# EasyEDA schematic SCH_Pico-Greenhouse-PCB_2026-05-27.json
TITLE: Greenhouse-Pico; REV: 2.2; Date: 2026-05-27; Sheet: 1/1; Drawn By: hiroyugane
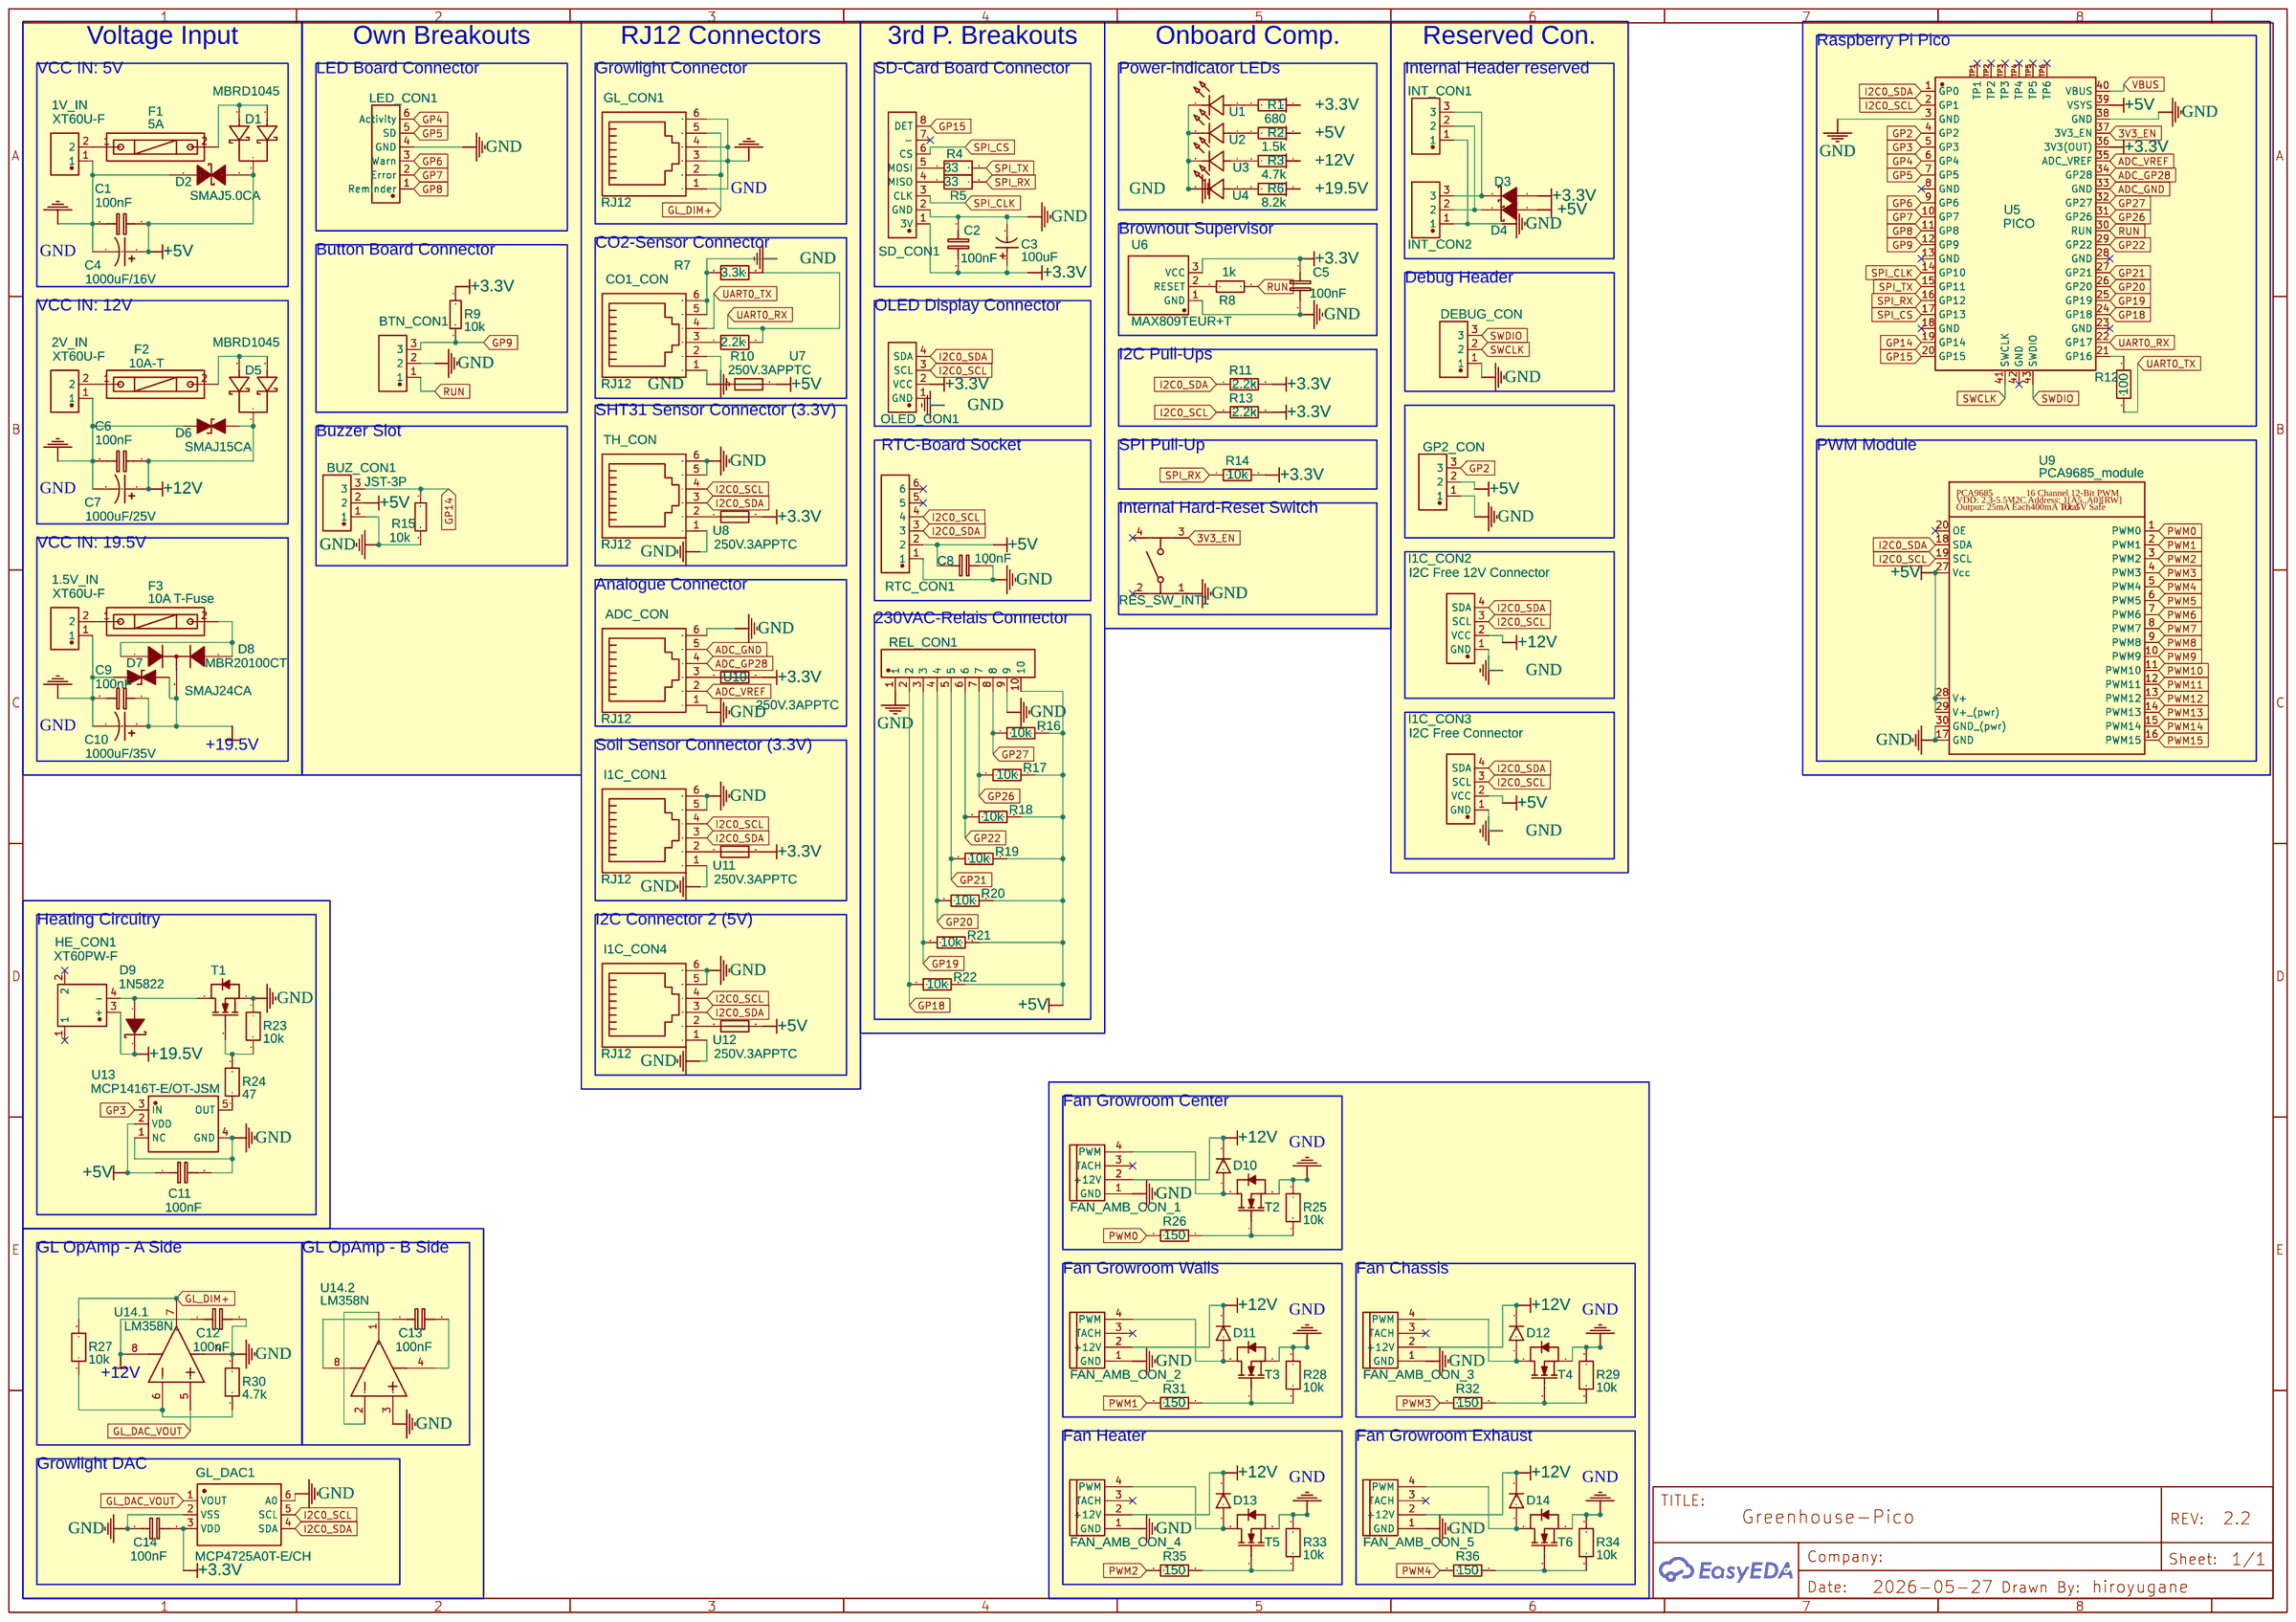
[diagram p0: schematic sheet]

## Parts
1.5V_IN  XT60U-F  [CONN-TH_XT60U-F]
1V_IN  XT60U-F  [CONN-TH_XT60U-F]
2V_IN  XT60U-F  [CONN-TH_XT60U-F]
ADC_CON  RJ12  [RJ12-TH_95501-2661]
BTN_CON1  Reset / Menu Button  [BUZ_CON]
BUZ_CON1  JST-3P  [BUZ_CON]
C1  100nF  [CONDENSATOR-SMALL]
C2  100nF  [CONDENSATOR-SMALL]
C3  100uF  [CAP-TH_BD5.0-P2.00-D0.8-FD]
C4  1000uF/16V  [CAP-TH_BD12.5-P5.00-D0.8-FD]
C5  100nF  [CONDENSATOR-SMALL]
C6  100nF  [CONDENSATOR-SMALL]
C7  1000uF/25V  [CAP-TH_BD12.5-P5.00-D0.8-FD]
C8  100nF  [CONDENSATOR-SMALL]
C9  100nF  [CONDENSATOR-SMALL]
C10  1000uF/35V  [CAP-TH_BD12.5-P5.00-D0.8-FD]
C11  100nF  [CONDENSATOR-SMALL]
C12  100nF  [CONDENSATOR-SMALL]
C13  100nF  [CONDENSATOR-SMALL]
C14  100nF  [CONDENSATOR-SMALL]
CO1_CON  RJ12  [RJ12-TH_95501-2661]
D1  MBRD1045  [TO-252-3_L6.5-W5.9-P4.60-LS10.0-BL]
D2  SMAJ5.0CA  [SMA_L4.4-W2.6-LS5.0-BI]
D3  SS14  [SMA_L4.2-W2.6-LS5.0-RD_1]
D4  SS14  [SMA_L4.2-W2.6-LS5.0-RD_1]
D5  MBRD1045  [TO-252-3_L6.5-W5.9-P4.60-LS10.0-BL]
D6  SMAJ15CA  [SMA_L4.4-W2.6-LS5.0-BI]
D7  SMAJ24CA  [SMA_L4.4-W2.6-LS5.0-BI]
D8  MBR20100CT  [TO-220-3_L10.0-W4.5-P2.54-L]
D9  1N5822  [DO-201AD_BD5.3-L8.4-P12.50-D1.4-FD]
D10  UF4007_C84067  [DO-41_BD2.4-L4.7-P8.70-D0.9-FD]
D11  UF4007_C84067  [DO-41_BD2.4-L4.7-P8.70-D0.9-FD]
D12  UF4007_C84067  [DO-41_BD2.4-L4.7-P8.70-D0.9-FD]
D13  UF4007_C84067  [DO-41_BD2.4-L4.7-P8.70-D0.9-FD]
D14  UF4007_C84067  [DO-41_BD2.4-L4.7-P8.70-D0.9-FD]
DEBUG_CON  B3B-XH-A-BK(LF)(SN)  [CONN-TH_3P-P2.50_B3B-XH-A-BK-LF-SN]
F1  5A  [FUSE-TH_L22.6-W9.0]
F2  10A-T  [FUSE-TH_L22.6-W9.0]
F3  10A T-Fuse  [FUSE-TH_L22.6-W9.0]
FAN_AMB_CON_1  XH2.54-4AW  [CONN-TH_XH2.54-4AW]
FAN_AMB_CON_2  XH2.54-4AW  [CONN-TH_XH2.54-4AW]
FAN_AMB_CON_3  XH2.54-4AW  [CONN-TH_XH2.54-4AW]
FAN_AMB_CON_4  XH2.54-4AW  [CONN-TH_XH2.54-4AW]
FAN_AMB_CON_5  XH2.54-4AW  [CONN-TH_XH2.54-4AW]
GL_CON1  RJ12  [RJ12-TH_95501-2661]
GL_DAC1  MCP4725A0T-E/CH  [SOT-23-6_L2.9-W1.6-P0.95-LS2.8-BL]
GP2_CON  GP2 Reserved  [CONN-TH_3P-P2.50_B3B-XH-A-BK-LF-SN]
HE_CON1  XT60PW-F  [TH_2P-XT60PW-F]
I1C_CON1  RJ12  [RJ12-TH_95501-2661]
I1C_CON2  I2C Free 12V Connector  [CONN-TH_4P-P2.50_JST_B4B-XH-A-M]
I1C_CON3  I2C Free Connector  [CONN-TH_4P-P2.50_JST_B4B-XH-A-M]
I1C_CON4  RJ12  [RJ12-TH_95501-2661]
INT_CON1  GP2 Reserved  [CONN-TH_3P-P2.50_B3B-XH-A-BK-LF-SN]
INT_CON2  GP2 Reserved  [CONN-TH_3P-P2.50_B3B-XH-A-BK-LF-SN]
LED_CON1  Led-PCB-Connector  [CONN-TH_6P-P2.50_JST_B6B-EH-LF-SN]
OLED_CON1  JST-4P  [CONN-TH_4P-P2.50_JST_B4B-XH-A-M]
R1  680  [RES-TH_BD2.3-L6.5-P6.9-D0.5]
R2  1.5k  [RES-TH_BD2.3-L6.5-P6.9-D0.5]
R3  4.7k  [RES-TH_BD2.3-L6.5-P6.9-D0.5]
R4  33  [R_TH]
R5  33  [R_TH]
R6  8.2k  [RES-TH_BD2.3-L6.5-P6.9-D0.5]
R7  3.3k  [R_TH]
R8  1k  [RES-TH_BD2.3-L6.5-P6.9-D0.5]
R9  10k  [RES-TH_BD2.3-L6.5-P6.9-D0.5]
R10  2.2k  [R_TH]
R11  2.2k  [RES-TH_BD2.3-L6.5-P6.9-D0.5]
R12  100  [R_TH]
R13  2.2k  [RES-TH_BD2.3-L6.5-P6.9-D0.5]
R14  10k  [RES-TH_BD2.3-L6.5-P6.9-D0.5]
R15  10k  [RES-TH_BD2.3-L6.5-P6.9-D0.5]
R16  10k  [RES-TH_BD2.3-L6.5-P6.9-D0.5]
R17  10k  [RES-TH_BD2.3-L6.5-P6.9-D0.5]
R18  10k  [RES-TH_BD2.3-L6.5-P6.9-D0.5]
R19  10k  [RES-TH_BD2.3-L6.5-P6.9-D0.5]
R20  10k  [RES-TH_BD2.3-L6.5-P6.9-D0.5]
R21  10k  [RES-TH_BD2.3-L6.5-P6.9-D0.5]
R22  10k  [RES-TH_BD2.3-L6.5-P6.9-D0.5]
R23  10k  [R_TH]
R24  47  [R_TH]
R25  10k  [R_TH]
R26  150  [RES-TH_BD2.3-L6.5-P6.9-D0.5]
R27  10k  [R_TH]
R28  10k  [R_TH]
R29  10k  [R_TH]
R30  4.7k  [R_TH]
R31  150  [RES-TH_BD2.3-L6.5-P6.9-D0.5]
R32  150  [RES-TH_BD2.3-L6.5-P6.9-D0.5]
R33  10k  [R_TH]
R34  10k  [R_TH]
R35  150  [RES-TH_BD2.3-L6.5-P6.9-D0.5]
R36  150  [RES-TH_BD2.3-L6.5-P6.9-D0.5]
REL_CON1  CONN-TH-10P  [CONN-TH_10P-P2.50_JST_B10B-EH]
RES_SW_INT1  Button  [SW-TH_4P-L6.0-W6.0-P4.50-LS6.1]
RTC_CON1  JST-6P  [RTC-CHIP FOOTPRINT]
SD_CON1  Adafruit SD Con  [CONN-TH_8P-P2.50-XH2.54-8P]
T1  IRLZ44NPBF-VB  [TO-220-3_L10.0-W4.5-P2.54-L-2]
T2  IRLZ44NPBF-VB  [TO-220-3_L10.0-W4.5-P2.54-L-2]
T3  IRLZ44NPBF-VB  [TO-220-3_L10.0-W4.5-P2.54-L-2]
T4  IRLZ44NPBF-VB  [TO-220-3_L10.0-W4.5-P2.54-L-2]
T5  IRLZ44NPBF-VB  [TO-220-3_L10.0-W4.5-P2.54-L-2]
T6  IRLZ44NPBF-VB  [TO-220-3_L10.0-W4.5-P2.54-L-2]
TH_CON  RJ12  [RJ12-TH_95501-2661]
U1  3RC  [LED-TH_BD3.0-2P-P2.50]
U2  3RC  [LED-TH_BD3.0-2P-P2.50]
U3  3RC  [LED-TH_BD3.0-2P-P2.50]
U4  3RC  [LED-TH_BD3.0-2P-P2.50]
U5  PICO  [RPI-PICO-V2]
U6  MAX809TEUR+T  [SOT-23-3_L2.9-W1.6-P1.90-LS2.8-BR]
U7  250V.3APPTC  [FUSE-TH_L11.4-W3.0-P5.10-D0.8-S1.20]
U8  250V.3APPTC  [FUSE-TH_L11.4-W3.0-P5.10-D0.8-S1.20]
U9  PCA9685_module  [PCA9685]
U10  250V.3APPTC  [FUSE-TH_L11.4-W3.0-P5.10-D0.8-S1.20]
U11  250V.3APPTC  [FUSE-TH_L11.4-W3.0-P5.10-D0.8-S1.20]
U12  250V.3APPTC  [FUSE-TH_L11.4-W3.0-P5.10-D0.8-S1.20]
U13  MCP1416T-E/OT-JSM  [SOT-23-5_L3.0-W1.6-P0.95-LS2.8-BR]
U14  LM358N  [PDIP-8_L10.2-W5.9-P2.54-LS7.6-BL]  (sections 1,2)

## Library data of the parts
1.5V_IN 1V_IN 2V_IN = XT60U-F: Supplier: LCSC; Supplier Part: C19191801; Manufacturer: AMASS(艾迈斯); JLCPCB Part Class: Extended Part; Contributor: lcsc
ADC_CON CO1_CON GL_CON1 I1C_CON1 I1C_CON4 TH_CON = 95501-2661: Contributor: LCSC; Supplier: LCSC; Supplier Part: C240856; Manufacturer: MOLEX; Manufacturer Part: 955012661; JLCPCB Part Class: Extended Part
BTN_CON1 BUZ_CON1 DEBUG_CON GP2_CON INT_CON1 INT_CON2 = B3B-XH-A-BK(LF)(SN): Contributor: LCSC; Supplier: LCSC; Supplier Part: C493416; Manufacturer: JST; JLCPCB Part Class: Extended Part
C1 C2 C5 C6 C8 C9 C11-C14 = C_0603_EU: Contributor: LCEDA_Lib
C3 = 100uf/10V: Supplier: LCSC; Manufacturer: Chengx(承兴); Manufacturer Part: KM107M010D11RR0VH2FP0; Supplier Part: C2035; JLCPCB Part Class: Extended Part
C4 C7 C10 = 50ZLJ1000M12.5X30: Contributor: lcsc; Supplier: LCSC; Supplier Part: C5115376; Manufacturer: rubycon(红宝石)
D1 D5 = MBRD1045: Supplier: LCSC; Supplier Part: C5137764; Manufacturer: GOODWORK(固得沃克); JLCPCB Part Class: Extended Part; Contributor: lcsc
D2 = SMAJ5.0CA_C143136: Contributor: LCSC; Supplier Part: C143136; Supplier: LCSC; Manufacturer: FMS(美丽微); JLCPCB Part Class: Extended Part
D3 D4 = SS14: Supplier: LCSC; Manufacturer: MDD(辰达半导体); Supplier Part: C2480; JLCPCB Part Class: Basic Part
D6 = SMAJ15CA: Supplier: LCSC; Manufacturer: RUILON(瑞隆源); Supplier Part: C46985; JLCPCB Part Class: Extended Part
D7 = SMAJ24CA: Supplier: LCSC; Manufacturer: RUILON(瑞隆源); Supplier Part: C28092; JLCPCB Part Class: Extended Part
D8 = MBR20100CT: Supplier: LCSC; Manufacturer: CJ(江苏长电/长晶); Supplier Part: C98706; JLCPCB Part Class: Extended Part
D9 = 1N5822: Supplier: LCSC; Manufacturer: MDD(辰达半导体); Supplier Part: C2476; JLCPCB Part Class: Extended Part
D10-D14 = UF4007_C84067: Contributor: 立创EDA官方封装库; Supplier: LCSC; Manufacturer: 星海; Manufacturer Part: UF4007; Supplier Part: C84067; JLCPCB Part Class: Extended Part
F1-F3 = 5x20 BLX-Atype Fuse holder XC-7: Supplier: LCSC; Manufacturer Part: 5x20 BLX-A型 保险丝支架 XC-7; Manufacturer: xcfuse(旭程); Supplier Part: C3131; JLCPCB Part Class: Extended Part
FAN_AMB_CON_1-FAN_AMB_CON_5 = XH2.54-4AW: Supplier: LCSC; Manufacturer: BOOMELE(博穆精密); Manufacturer Part: XH-4AW; Supplier Part: C21273; JLCPCB Part Class: Extended Part
GL_DAC1 = MCP4725A0T-E/CH: Contributor: LCSC; Supplier: LCSC; Manufacturer: MICROCHIP(美国微芯); Supplier Part: C144198; JLCPCB Part Class: Extended Part
HE_CON1 = XT60PW-F_C428722: Supplier: LCSC; Supplier Part: C428722; Manufacturer: AMASS(艾迈斯); JLCPCB Part Class: Extended Part; Contributor: lcsc
I1C_CON2 I1C_CON3 OLED_CON1 = B4B-XH-A-R(LF)(SN): Contributor: lcsc; Supplier: LCSC; Supplier Part: C595709; Manufacturer: JST; JLCPCB Part Class: Extended Part
LED_CON1 = B6B-EH(LF)(SN): Contributor: LCSC; Supplier: LCSC; Supplier Part: C493147; Manufacturer: JST; JLCPCB Part Class: Extended Part
R1-R3 R6 R8 R9 R11 R13-R22 R26 R31 R32 R35 R36 = 330Ω (331) ±5%: Contributor: LCSC; Supplier: LCSC; Supplier Part: C10322; Manufacturer: Made in China; JLCPCB Part Class: Extended Part
R4 R5 R7 R10 R12 R23-R25 R27-R30 R33 R34 = R_0603_EU: Contributor: LCEDA_Lib
REL_CON1 = B10B-EH(LF)(SN): Contributor: lcsc; Supplier: LCSC; Supplier Part: C265062; Manufacturer: JST; JLCPCB Part Class: Extended Part
RES_SW_INT1 = Button-6x6x6mm: Supplier Part: C71836; Supplier: LCSC; Manufacturer: BBJ; Manufacturer Part: Switch,6*6*6Plastic head,260G, 0.25mm,Straight line
RTC_CON1 = ZX-PM2.54-1-6PY: Supplier: LCSC; Supplier Part: C7499326; Manufacturer: Megastar(兆星); Contributor: lcsc; JLCPCB Part Class: Extended Part
SD_CON1 = HDGC2501WV-8P: Supplier: LCSC; Supplier Part: C5175254; Manufacturer: HDGC(华德共创); JLCPCB Part Class: Extended Part; Contributor: lcsc
T1-T6 = IRLZ44NPBF-VB: Supplier: LCSC; Supplier Part: C20755022; Manufacturer: VBsemi(微碧半导体); JLCPCB Part Class: Extended Part; Contributor: lcsc
U1-U4 = 3RC: Supplier: LCSC; Supplier Part: C19479802; Manufacturer: BIVAR; JLCPCB Part Class: Extended Part; Contributor: lcsc
U5 = PICO: Supplier: LCSC; Supplier Part: C7203002; Manufacturer: Raspberry Pi(树莓派); Contributor: lcsc; JLCPCB Part Class: Extended Part
U6 = MAX809TEUR+T: Supplier: LCSC; Manufacturer: ADI(亚德诺)/MAXIM(美信); Supplier Part: C16711; JLCPCB Part Class: Extended Part
U7 U8 U10-U12 = 30V3APPTC: Contributor: lcsc; Supplier: LCSC; Supplier Part: C9900014925; Manufacturer: null; JLCPCB Part Class: Extended Part
U9 = PCA9685_module: Contributor: Quentin Chatenet
U13 = MCP1416T-E/OT-JSM: Supplier: LCSC; Supplier Part: C18195002; Manufacturer: JSMSEMI(杰盛微); Contributor: lcsc; JLCPCB Part Class: Extended Part
U14 = LM358N: subpart_no: 1; Supplier: LCSC; Supplier Part: C83405; Manufacturer: TI(德州仪器); Manufacturer Part: LM358N/NOPB; JLCPCB Part Class: Extended Part

## Nets
3V3_EN: RES_SW_INT1.3 U5.37(3V3_EN)
+3.3V: C2.2 C3.1 C5.1 C14.2 D3.2(A) GL_DAC1.3(VDD) OLED_CON1.2(VCC) R1.1 R9.2 R11.2 R13.2 R14.2 SD_CON1.1(3V) U5.36(3V3(OUT)) U6.3(VCC) U8.2 U10.2 U11.2
+5V: BUZ_CON1.2 C1.1 C4.1 C8.1 C11.1 D1.2(K) D2.1 D4.2(A) GP2_CON.2 I1C_CON3.2(VCC) R2.1 R16.2 R17.2 R18.2 R19.2 R20.2 R21.2 R22.2 REL_CON1.10 RTC_CON1.2 U5.39(VSYS) U7.2 U9.27(Vcc) U9.28(V+) U9.29(V+ (pwr)) U12.2 U13.2(VDD)
+12V: C6.1 C7.1 C12.1 D5.2(K) D6.1(K) D10.2(C) D11.2(C) D12.2(C) D13.2(C) D14.2(C) FAN_AMB_CON_1.2(+12V) FAN_AMB_CON_2.2(+12V) FAN_AMB_CON_3.2(+12V) FAN_AMB_CON_4.2(+12V) FAN_AMB_CON_5.2(+12V) I1C_CON2.2(VCC) R3.1
+19.5V: C9.1 C10.1 D7.1(K) D8.2(C) D9.2(K) HE_CON1.3(+) R6.1
GND: 1.5V_IN.1 1V_IN.1 2V_IN.1 ADC_CON.1 ADC_CON.6 BTN_CON1.2 BUZ_CON1.1 C1.2 C2.1 C3.2 C4.2 C5.2 C6.2 C7.2 C8.2 C9.2 C10.2 C11.2 C12.2 C14.1 CO1_CON.1 CO1_CON.5 CO1_CON.6 D2.2 D6.2(A) D7.2(A) DEBUG_CON.1 FAN_AMB_CON_1.1(GND) FAN_AMB_CON_2.1(GND) FAN_AMB_CON_3.1(GND) FAN_AMB_CON_4.1(GND) FAN_AMB_CON_5.1(GND) GL_CON1.1 GL_CON1.3(GL-) GL_CON1.4(GL-) GL_CON1.6 GL_DAC1.2(VSS) GL_DAC1.6(A0) GP2_CON.1 I1C_CON1.1 I1C_CON1.5 I1C_CON1.6 I1C_CON2.1(GND) I1C_CON3.1(GND) I1C_CON4.1 I1C_CON4.5 I1C_CON4.6 INT_CON1.1 INT_CON2.1 LED_CON1.4(GND) OLED_CON1.1(GND) R7.1 R15.2 R23.1 R25.2 R28.2 R29.2 R30.2 R33.2 R34.2 REL_CON1.1 REL_CON1.9 RES_SW_INT1.1 RTC_CON1.1 SD_CON1.2(GND) T1.3(S) T2.3(S) T3.3(S) T4.3(S) T5.3(S) T6.3(S) TH_CON.1 TH_CON.5 TH_CON.6 U1.2(K) U2.2(K) U3.2(K) U4.2(K) U5.3(GND) U5.38(GND) U6.1(GND) U9.17(GND) U9.30(GND (pwr)) U13.1(NC) U13.4(GND) U14.3(+IN 1)
VBUS: U5.40(VBUS)
ADC_GND: ADC_CON.5 U5.33(GND)
ADC_GP28: ADC_CON.4 U5.34(GP28)
ADC_VREF: ADC_CON.2 U5.35(ADC_VREF)
GL_DAC_VOUT: GL_DAC1.1(VOUT) U14.5(+IN 2)
GL_DIM+: GL_CON1.2(GL+) GL_CON1.5(GL+) R27.2 U14.7(OUT 2)
GP2: GP2_CON.3 U5.4(GP2)
GP3: U5.5(GP3) U13.3(IN)
GP4: LED_CON1.6(Activity) U5.6(GP4)
GP5: LED_CON1.5(SD) U5.7(GP5)
GP6: LED_CON1.3(Warn) U5.9(GP6)
GP7: LED_CON1.2(Error) U5.10(GP7)
GP8: LED_CON1.1(Reminder) U5.11(GP8)
GP9: BTN_CON1.3 R9.1 U5.12(GP9)
GP14: BUZ_CON1.3 R15.1 U5.19(GP14)
GP15: SD_CON1.8(DET) U5.20(GP15)
GP18: R22.1 REL_CON1.2 U5.24(GP18)
GP19: R21.1 REL_CON1.3 U5.25(GP19)
GP20: R20.1 REL_CON1.4 U5.26(GP20)
GP21: R19.1 REL_CON1.5 U5.27(GP21)
GP22: R18.1 REL_CON1.6 U5.29(GP22)
GP26: R17.1 REL_CON1.7 U5.31(GP26)
GP27: R16.1 REL_CON1.8 U5.32(GP27)
I2C0_SCL: GL_DAC1.5(SCL) I1C_CON1.4 I1C_CON2.3(SCL) I1C_CON3.3(SCL) I1C_CON4.4 OLED_CON1.3(SCL) R13.1 RTC_CON1.4 TH_CON.4 U5.2(GP1) U9.19(SCL)
I2C0_SDA: GL_DAC1.4(SDA) I1C_CON1.3 I1C_CON2.4(SDA) I1C_CON3.4(SDA) I1C_CON4.3 OLED_CON1.4(SDA) R11.1 RTC_CON1.3 TH_CON.3 U5.1(GP0) U9.18(SDA)
PWM0: R26.2 U9.1(PWM0)
PWM1: R31.2 U9.2(PWM1)
PWM2: R35.2 U9.3(PWM2)
PWM3: R32.2 U9.4(PWM3)
PWM4: R36.2 U9.5(PWM4)
PWM5: U9.6(PWM5)
PWM6: U9.7(PWM6)
PWM7: U9.8(PWM7)
PWM8: U9.9(PWM8)
PWM9: U9.10(PWM9)
PWM10: U9.11(PWM10)
PWM11: U9.12(PWM11)
PWM12: U9.13(PWM12)
PWM13: U9.14(PWM13)
PWM14: U9.15(PWM14)
PWM15: U9.16(PWM15)
RUN: BTN_CON1.1 R8.2 U5.30(RUN)
SPI_CLK: SD_CON1.3(CLK) U5.14(GP10)
SPI_CS: SD_CON1.6(CS) U5.17(GP13)
SPI_RX: R5.2 R14.1 U5.16(GP12)
SPI_TX: R4.2 U5.15(GP11)
SWCLK: DEBUG_CON.2 U5.41(SWCLK)
SWDIO: DEBUG_CON.3 U5.43(SWDIO)
UART0_RX: R7.2 R10.2 U5.22(GP17)
UART0_TX: CO1_CON.4 R12.2
Net-(1.5V_IN-2): 1.5V_IN.2 F3.1
Net-(1V_IN-2): 1V_IN.2 F1.1
Net-(2V_IN-2): 2V_IN.2 F2.1
Net-(ADC_CON-3): ADC_CON.3 U10.1
Net-(C13-1): C13.1 U14.8(+V)
Net-(C13-2): C13.2 U14.4(-V)
Net-(CO1_CON-2): CO1_CON.2 U7.1
Net-(CO1_CON-3): CO1_CON.3 R10.1
Net-(D1-1): D1.1(A) D1.3(A) F1.2
Net-(D3-1): D3.1(K) INT_CON1.3 INT_CON2.3
Net-(D4-1): D4.1(K) INT_CON1.2 INT_CON2.2
Net-(D5-1): D5.1(A) D5.3(A) F2.2
Net-(D8-1): D8.1(A) D8.3(A) F3.2
Net-(D9-1): D9.1(A) HE_CON1.4(-) T1.2(D)
Net-(D10-1): D10.1(A) FAN_AMB_CON_1.4(PWM) T2.2(D)
Net-(D11-1): D11.1(A) FAN_AMB_CON_2.4(PWM) T3.2(D)
Net-(D12-1): D12.1(A) FAN_AMB_CON_3.4(PWM) T4.2(D)
Net-(D13-1): D13.1(A) FAN_AMB_CON_4.4(PWM) T5.2(D)
Net-(D14-1): D14.1(A) FAN_AMB_CON_5.4(PWM) T6.2(D)
Net-(I1C_CON1-2): I1C_CON1.2 U11.1
Net-(I1C_CON4-2): I1C_CON4.2 U12.1
Net-(R1-2): R1.2 U1.1(A)
Net-(R2-2): R2.2 U2.1(A)
Net-(R3-2): R3.2 U3.1(A)
Net-(R4-1): R4.1 SD_CON1.5(MOSI)
Net-(R5-1): R5.1 SD_CON1.4(MISO)
Net-(R6-2): R6.2 U4.1(A)
Net-(R8-1): R8.1 U6.2(RESET)
Net-(R12-1): R12.1 U5.21(GP16)
Net-(R23-2): R23.2 R24.2 T1.1(G)
Net-(R24-1): R24.1 U13.5(OUT)
Net-(R25-1): R25.1 R26.1 T2.1(G)
Net-(R27-1): R27.1 R30.1 U14.6(-IN 2)
Net-(R28-1): R28.1 R31.1 T3.1(G)
Net-(R29-1): R29.1 R32.1 T4.1(G)
Net-(R33-1): R33.1 R35.1 T5.1(G)
Net-(R34-1): R34.1 R36.1 T6.1(G)
Net-(TH_CON-2): TH_CON.2 U8.1
Net-(U14.2-1): U14.1(OUT 1) U14.2(-IN 1)

Not connected (* = marked no-connect by the designer): FAN_AMB_CON_1 3(TACH)*; FAN_AMB_CON_2 3(TACH)*; FAN_AMB_CON_3 3(TACH)*; FAN_AMB_CON_4 3(TACH)*; FAN_AMB_CON_5 3(TACH)*; HE_CON1 1* 2*; RES_SW_INT1 2* 4*; RTC_CON1 5* 6*; SD_CON1 7(-)*; U5 8(GND)* 13(GND)* 18(GND)* 23(GND)* 28(GND)* 42(GND)* TP1* TP2* TP3* TP4* TP5* TP6*; U9 20(OE)*

## Notes on the sheet
- Voltage Input
- Own Breakouts
- RJ12 Connectors
- 3rd P. Breakouts
- Onboard Comp.
- Reserved Con.
- Raspberry Pi Pico
- VCC IN: 5V
- LED Board Connector
- Growlight Connector
- SD-Card Board Connector
- Power-indicator LEDs
- Internal Header reserved
- Brownout Supervisor
- CO2-Sensor Connector
- Button Board Connector
- Debug Header
- VCC IN: 12V
- OLED Display Connector
- I2C Pull-Ups
- SHT31 Sensor Connector (3.3V)
- Buzzer Slot
- RTC-Board Socket
- SPI Pull-Up
- PWM Module
- Internal Hard-Reset Switch
- VCC IN: 19.5V
- Analogue Connector
- 230VAC-Relais Connector
- Soil Sensor Connector (3.3V)
- Heating Circuitry
- I2C Connector 2 (5V)
- Fan Growroom Center
- GL OpAmp - A Side
- GL OpAmp - B Side
- Fan Growroom Walls
- Fan Chassis
- Fan Heater
- Fan Growroom Exhaust
- Growlight DAC
